# Altium project PCB_Project.PrjPcb
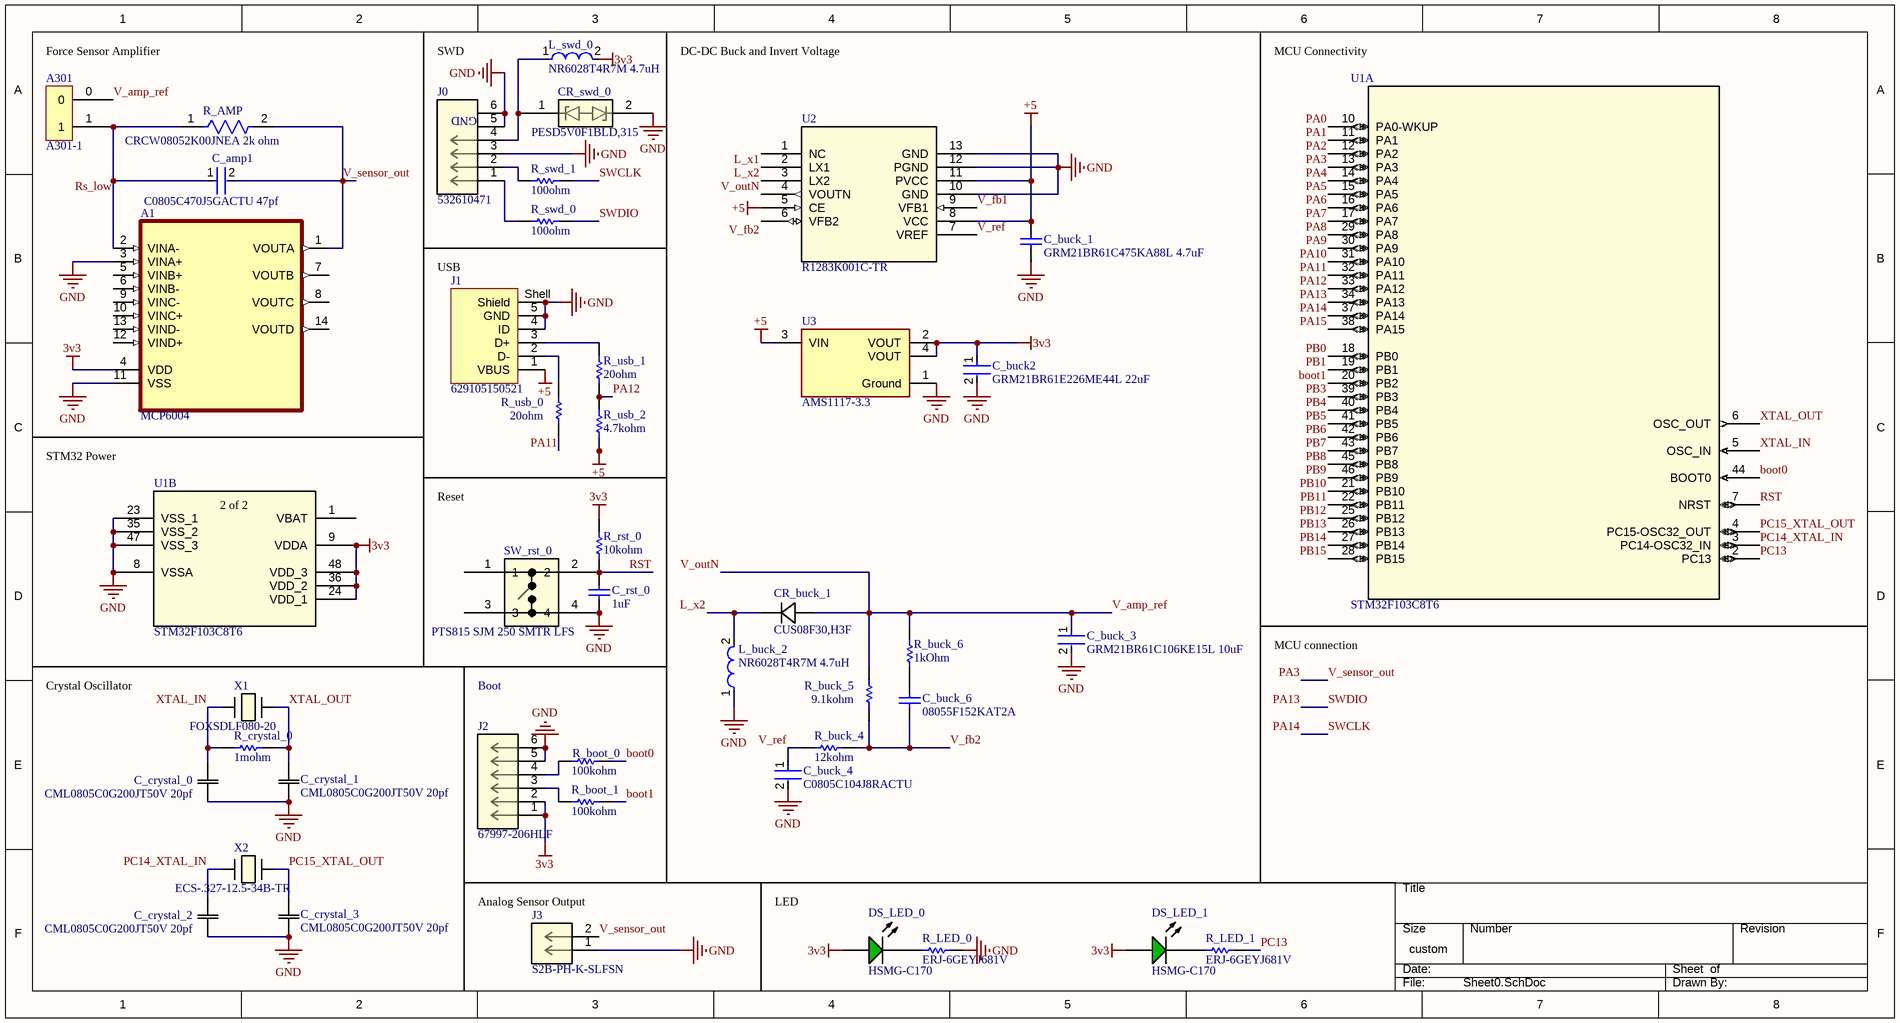
[diagram p0: Sheet0.SchDoc]
1 sheet, 44 parts. Net scope: global (net labels, ports and power ports of the same name join across sheets).
Board file: PCB.PcbDoc

## Sheet Sheet0.SchDoc
size 355 x 190 mm; SheetNumber: 1; SheetTotal: 1

### Parts
A1  MCP6004  [SOP65P640X120-14N]
A301  A301-1  [A301-1]
C_amp1  C0805C470J5GACTU 47pf  [FP-C0805C-DN-MFG]
C_buck2  GRM21BR61E226ME44L 22uF  [FP-GRM21B-0_2-e0_2_0_7-IPC_B]
C_buck_1  GRM21BR61C475KA88L 4.7uF  [CAPC2013X135X45LL10T25]
C_buck_3  GRM21BR61C106KE15L 10uF  [FP-GRM21B-0_1-IPC_C]
C_buck_4  C0805C104J8RACTU  [FP-C0805C-DN-MFG]
C_buck_6  08055F152KAT2A  [CAPC2013X140X50ML20T25]
C_crystal_0  CML0805C0G200JT50V 20pf  [CAP_CML_0805_.3pF-1500pF,4700pF_STP]
C_crystal_1  CML0805C0G200JT50V 20pf  [CAP_CML_0805_.3pF-1500pF,4700pF_STP]
C_crystal_2  CML0805C0G200JT50V 20pf  [CAP_CML_0805_.3pF-1500pF,4700pF_STP]
C_crystal_3  CML0805C0G200JT50V 20pf  [CAP_CML_0805_.3pF-1500pF,4700pF_STP]
C_rst_0  1uF  [CAPC2013X140X50ML20T25]
CR_buck_1  CUS08F30,H3F  [USC_TOS]
CR_swd_0  PESD5V0F1BLD,315  [DFN1006D-2_SOD882D_NEX]
DS_LED_0  HSMG-C170  [AVAG-HSMX-C170_V]
DS_LED_1  HSMG-C170  [AVAG-HSMX-C170_V]
J0  532610471  [CONN_532610001-SD_04_MOL]
J1  629105150521  [629105150521]
J2  67997-206HLF  [6Pins_AMP]
J3  S2B-PH-K-SLFSN  [CONN_S2B-PH-K-S_JST]
L_buck_2  NR6028T4R7M 4.7uH  [FP-NR6028-MFG]
L_swd_0  NR6028T4R7M 4.7uH  [FP-NR6028-MFG]
R_AMP  CRCW08052K00JNEA 2k ohm  [FP-CRCW0805-e3-MFG]
R_boot_0  100kohm  [RESC2013X70X40ML20T20]
R_boot_1  100kohm  [RESC2013X70X40ML20T20]
R_buck_4  12kohm  [RESC2013X60X40ML20T25]
R_buck_5  9.1kohm  [RESC2013X70X40NL20T20]
R_buck_6  1kOhm  [RESC2013X60X35ML10T20]
R_crystal_0  1mohm  [RESC2013X50X30LL20T20]
R_LED_0  ERJ-6GEYJ681V  [RESC2013X70X40LL20T20]
R_LED_1  ERJ-6GEYJ681V  [RESC2013X70X40LL20T20]
R_rst_0  10kohm  [RESC2013X60X40LL20T25_A]
R_swd_0  100ohm  [RESC2013X60X40ML20T25]
R_swd_1  100ohm  [RESC2013X60X40ML20T25]
R_usb_0  20ohm  [RESC2013X70X40ML20T20]
R_usb_1  20ohm  [RESC2013X70X40ML20T20]
R_usb_2  4.7kohm  [RESC2013X60X40ML20T25]
SW_rst_0  PTS815 SJM 250 SMTR LFS  [SW4_PTS815 SJM 250 SMTR LFS_CNK]
U1  STM32F103C8T6  [LQFP48_STM]  (parts A,B of 2)
U2  R1283K001C-TR  [PE-DFNPL2730-12-180404_NMD]
U3  AMS1117-3.3  [FP-AMS1117-IPC_C]
X1  FOXSDLF080-20  [CRYSTAL_HC49SDLF_FXT]
X2  ECS-.327-12.5-34B-TR  [XTAL_ECS-31B_ECS]

### Nets
3v3: A1.4(VDD) C_buck2.1 DS_LED_0.1(A) DS_LED_1.1(A) J2.1 J2.2 L_swd_0.2 R_rst_0.2 U1.9(VDDA) U1.24(VDD_1) U1.36(VDD_2) U1.48(VDD_3) U3.2(VOUT) U3.4(VOUT)
+5: C_buck_1.2 J1.1(VBUS) R_usb_2.1 U2.5(CE) U2.8(VCC) U2.11(PVCC) U3.3(VIN)
GND: A1.3(VINA+) A1.11(VSS) C_buck2.2 C_buck_1.1 C_buck_3.2 C_buck_4.2 C_crystal_0.1 C_crystal_1.1 C_crystal_2.1 C_crystal_3.1 C_rst_0.1 CR_swd_0.2 J0.3 J0.5 J0.6 J1.4(ID) J1.5(GND) J1.Shell(Shield) J2.5 J2.6 J3.1 L_buck_2.1 R_LED_0.2 SW_rst_0.4 U1.8(VSSA) U1.23(VSS_1) U1.35(VSS_2) U1.47(VSS_3) U2.10(GND) U2.12(PGND) U2.13(GND) U3.1(Ground)
boot0: R_boot_0.2 U1.44(BOOT0)
boot1: R_boot_1.2 U1.20(PB2)
L_x1: U2.2(LX1)
L_x2: CR_buck_1.1(cathode) L_buck_2.2 U2.3(LX2)
PA0: U1.10(PA0-WKUP)
PA1: U1.11(PA1)
PA2: U1.12(PA2)
PA3: A1.1(VOUTA) C_amp1.2 J3.2 R_AMP.2 U1.13(PA3)  [also labelled V_sensor_out]
PA4: U1.14(PA4)
PA5: U1.15(PA5)
PA6: U1.16(PA6)
PA7: U1.17(PA7)
PA8: U1.29(PA8)
PA9: U1.30(PA9)
PA10: U1.31(PA10)
PA11: R_usb_0.1 U1.32(PA11)
PA12: R_usb_1.1 R_usb_2.2 U1.33(PA12)
PA13: R_swd_0.2 U1.34(PA13)  [also labelled SWDIO]
PA14: R_swd_1.2 U1.37(PA14)  [also labelled SWCLK]
PA15: U1.38(PA15)
PB0: U1.18(PB0)
PB1: U1.19(PB1)
PB3: U1.39(PB3)
PB4: U1.40(PB4)
PB5: U1.41(PB5)
PB6: U1.42(PB6)
PB7: U1.43(PB7)
PB8: U1.45(PB8)
PB9: U1.46(PB9)
PB10: U1.21(PB10)
PB11: U1.22(PB11)
PB12: U1.25(PB12)
PB13: U1.26(PB13)
PB14: U1.27(PB14)
PB15: U1.28(PB15)
PC13: R_LED_1.2 U1.2(PC13)
PC14_XTAL_IN: C_crystal_2.2 U1.3(PC14-OSC32_IN) X2.1
PC15_XTAL_OUT: C_crystal_3.2 U1.4(PC15-OSC32_OUT) X2.2
Rs_low: A1.2(VINA-) A301.1 C_amp1.1 R_AMP.1
RST: C_rst_0.2 R_rst_0.1 SW_rst_0.2 U1.7(NRST)
V_amp_ref: A301.0 C_buck_3.1 CR_buck_1.2(anode) R_buck_5.2 R_buck_6.2 U2.4(VOUTN)  [also labelled V_outN]
V_fb1: U2.9(VFB1)
V_fb2: C_buck_6.1 R_buck_4.2 R_buck_5.1 U2.6(VFB2)
V_ref: C_buck_4.1 R_buck_4.1 U2.7(VREF)
XTAL_IN: C_crystal_0.2 R_crystal_0.1 U1.5(OSC_IN) X1.1
XTAL_OUT: C_crystal_1.2 R_crystal_0.2 U1.6(OSC_OUT) X1.2
NetC_buck_6_2: C_buck_6.2 R_buck_6.1
NetCR_swd_0_1: CR_swd_0.1 J0.4 L_swd_0.1
NetDS_LED_0_2: DS_LED_0.2(K) R_LED_0.1
NetDS_LED_1_2: DS_LED_1.2(K) R_LED_1.1
NetJ0_1: J0.1 R_swd_0.1
NetJ0_2: J0.2 R_swd_1.1
NetJ1_2: J1.2(D-) R_usb_0.2
NetJ1_3: J1.3(D+) R_usb_1.2
NetJ2_3: J2.3 R_boot_1.1
NetJ2_4: J2.4 R_boot_0.1

Not connected (* = marked no-connect by the designer): A1 5(VINB+) 6(VINB-) 7(VOUTB) 8(VOUTC) 9(VINC-) 10(VINC+) 12(VIND+) 13(VIND-) 14(VOUTD); SW_rst_0 1 3; U1 1(VBAT); U2 1(NC)

### Notes on the sheet
- (near A301) Force Sensor Amplifier
- SWD
- DC-DC Buck and Invert Voltage
- MCU Connectivity
- USB
- STM32 Power
- Reset
- Crystal Oscillator
- Boot
- MCU connection
- (near J3) Analog Sensor Output
- LED
- (in symbol 532610471) GND
- (in symbol STM32F103C8T6, part B) 2 of 2

### Library data of the parts
C_amp1 = CMP-2007-00435-2: CAP CER 47PF 50V C0G/NP0 0805; Manufacturer: KEMET; Temperature Characteristic: C0G; Temperature Coefficient: 30ppm/°C; Tolerance: 0.05; Temperature Range High: +125°C; Device Class L1: Passive Components; Device Class L3: Ceramic Capacitors; Lead Free: Yes; Manufacturer Part Number: C0805C470J5GACTU; Material: Ceramic; Temperature: -55°C to +125°C; Capacitance: 47 pF; Height: 0.88mm; Octopart: https://octopart.com/c0805c470j5gactu-kemet-150274; RoHS: TRUE; Category: Cap; Voltage Rating: 50 V; Automotive: No; Device Class L2: Capacitors; Value: 47 pF; Ipc Land Pattern Name: CAPC200125X78; Temperature Range Low: -55°C; Mouser Description: Multilayer Ceramic Capacitors MLCC - SMD/SMT 50volts 47pF C0G 5%; Package: C0805C-DN; Digikey Description: CAP CER 47PF 50V C0G/NP0 0805; ComponentLink2URL: https://content.kemet.com/datasheets/KEM_C1003_C0G_SMD.pdf; ComponentLink2Description: Datasheet
C_buck2 = CMP-2007-03222-3: Chip Multilayer Ceramic Capacitors for General Purpose, 0805, 22uF, X5R, 15%, 20%, 25V; Case/Package: 0805; Depth: 1.25mm; Resistor Type: Ceramic; Voltage Rating: 25V; Lead Free: Lead Free; Voltage Rating (DC): 25V; Case Code (Metric): 2012; Thickness: 0.057inch; REACH SVHC: No SVHC; Material: Ceramic; Tolerance: 20%; Length: 2mm; Capacitance: 22uF; Case Code (Imperial): 0805; Max Operating Temperature: 85°C; Termination: SMD/SMT; Weight: 0.000335oz; Dielectric: X5R; Packaging: Tape and Reel; Voltage: 25V; Package Quantity: 3000; Height: 1.25mm; Mount: Surface Mount; Width: 1.25mm; Min Operating Temperature: -55°C
C_buck_1 = CMP-1662-00015-2: Chip Capacitor, 4.7 uF, +/- 10%, 16 V, -55 to 85 degC, 0805 (2012 Metric), RoHS, Tape and Reel; Voltage Rating (DC): 16 V; Type (Capacitors): X5R; Case\/Package: 0805; Pins: 2; DatasheetVersion: 03/2016; REACH SVHC: No SVHC; Tolerance: 10%; PartNumber: GRM21BR61C475KA88L; Width: 1.25 mm; Capacitance: 4.7 uF; Mount: Surface Mount; ComponentLink1Description: Manufacturer URL; Case Code (Metric): 2012; PackageDescription: 2-Pin Surface Mount Device, Body 2 x 1.25 mm; Height: 1.25 mm; Voltage Rating: 16 V; Max Operating Temperature: 85 degC; RoHSCompliant: true; Length: 2 mm; ComponentLink1URL: http://www.murata.com/; Mounting Technology: Surface Mount; Packaging: Tape and Reel; Min Operating Temperature: -55 degC; ComponentLink2Description: Datasheet; Case Code (Imperial): 0805; Radiation Hardening: No; Package Quantity: 3000; PackageReference: 0805; ComponentLink2URL: http://search.murata.co.jp/Ceramy/image/img/A01X/G101/ENG/GRM21BR61C475KA88-01.pdf
C_buck_3 = CMP-2007-03453-2: Chip Multilayer Ceramic Capacitors for General Purpose, 0805, 10uF, X5R, 15%, 10%, 16V; Radiation Hardening: No; Thickness: 0.053inch; Voltage Rating (DC): 16V; Lead Free: Lead Free; Package Quantity: 1; Width: 1.25mm; Case Code (Imperial): 0805; Depth: 1.25mm; Packaging: Tape and Reel; Dielectric: X5R; Max Operating Temperature: 85°C; Tolerance: 10%; Voltage Rating: 16V; Voltage: 16V; Capacitance: 10uF; Height: 1.25mm; Case Code (Metric): 2012; Material: Ceramic; Mount: Surface Mount; Case/Package: 0805; REACH SVHC: No SVHC; Length: 2mm; Min Operating Temperature: -55°C; Termination: SMD/SMT
C_buck_4 = CMP-03020-032188-1: CAP CER 0.1UF 10V 5% X7R 0805; Manufacturer: KEMET; Tolerance: 0.05; Capacitance: 0.10 μF; Temperature Coefficient: 30ppm/°C; Value: 0.10 μF; Package: C0805C-DN; Device Class L1: Passive Components; Temperature: -55°C to +125°C; Category: Cap; RoHS: TRUE; Mouser Description: Multilayer Ceramic Capacitors MLCC - SMD/SMT 10volts 0.1uF X7R 5%; Lead Free: Yes; Temperature Range Low: -55°C; Material: Ceramic; Temperature Range High: +125°C; Device Class L2: Capacitors; Temperature Characteristic: X7R; Device Class L3: Ceramic Capacitors; ComponentLink2Description: Datasheet; Automotive: No; Ipc Land Pattern Name: CAPC200125X78; Manufacturer Part Number: C0805C104J8RACTU; Voltage Rating: 10 V; Height: 0.88mm; Digikey Description: CAP CER 0.1UF 10V 5% X7R 0805; Octopart: https://octopart.com/c0805c104j8ractu-kemet-11807087; ComponentLink2URL: https://content.kemet.com/datasheets/KEM_C1003_C0G_SMD.pdf
C_buck_6 = CMP-2007-04787-1: Manufacturer: AVX Interconnect / Elco; Part Number: 08055F152KAT2A
C_crystal_0-C_crystal_3 = CML0805C0G200JT50V: No Description Available; Mfr_Name: Stackpole International
C_rst_0 = CMP-2007-03236-1: Manufacturer: Kemet; Part Number: C0805C105K5RACTU
CR_buck_1 = CUS08F30,H3F: No Description Available; Mfr_Name: Toshiba Electronic Devices & Storage Corp.
CR_swd_0 = PESD5V0F1BLD,315: No Description Available; Mfr_Name: Nexperia; RefDes: RefDes; Type: Type
DS_LED_0 DS_LED_1 = CMP-2000-05062-1: Chip LED, Green, 2.2 V, -40 to 85 degC, 2-Pin SMD, Pb-Free, Tape and Reel; Manufacturer: Avago; No. of Pins: 2; Peak Wavelength: 570nm; SVHC: NoSVHC(16-Jun-2014); Dominant Wavelength: 572nm; Forward Current If: 20mA; Viewing Angle: 170deg; Lens Shape: Rectangular; PIV Max: 5V; External Width: 1.25mm; LED Type: Standard; External Depth: 0.8mm; Opto Mounting Orientation: Top; Luminous Intensity: 15mcd; Luminous Intensity Min: 4mcd; Forward Voltage VF Max: 2.6V; External Length / Height: 2mm; Bulb Size: 1.25mmx1.4mm; Light Area Height: 1mm; Voltage Vf Typ: 2.2V; Operating Temperature Max: 85degC; Datasheet Version: Oct-08; MSL: MSL2A-4weeks; Peak Forward Current: 20mA; Package Description: 2-Pin Surface Mount Device, Body 2 x 1.25 mm, Height 0.8 mm; Datasheet URL: https://datasheet.ciiva.com/29280/180495-da-01-en-chip-led-hsmg-c170-gelb-gruen-29280971.pdf; Storage Temperature Min: -40degC; LED Colour: Green; Wavelength Typ: 570nm; Mounting Type: SMD; Forward Current If Max: 20mA; Dominant Wavelength Typ: 572nm; LED Mounting: SMD; Operating Temperature Range: -30degCto+85degC; Operating Temperature Min: -30degC; Manufacturer URL: http://www.avagotech.com/; Packaging: CutTape; Luminous Intensity Typ: 15mcd; Package Reference: HSMX-C170; Storage Temperature Max: 85degC; Opto Case Style: SMD; Forward Voltage: 2.2V
J0 = 532610471: No Description Available; Mfr_Name: Molex Connector Corporation; RefDes: RefDes; Type: Type
J1 = CMP-1502-03252-3: NexarPartId: 52645113; Number of Contacts: 5; Contact Resistance: 30mΩ; Connector Type: USB; Voltage Rating: 30V; Current Rating: 3A; USB Standard: USB 2.0; Gender: Receptacle; Insulation Resistance: 1GΩ; Height: 2.86mm; REACH SVHC: Unknown; RoHS: Compliant; Features: Shielded; Termination: SMD/SMT; Number of Pins: 5; Contact Plating: Gold; Packaging: Tape and Reel; Contact Material: Gold; Mount: Horizontal, Surface Mount; Max Operating Temperature: 85°C; Lead Free: Lead Free; Min Operating Temperature: -40°C; Orientation: Horizontal; Operating Supply Voltage: 30V
J2 = 67997-206HLF: No Description Available; Mfr_Name: Amphenol ICC; RefDes: RefDes; Type: Type
J3 = S2B-PH-K-SLFSN: No Description Available; Mfr_Name: JST; RefDes: RefDes; Type: Type
L_buck_2 L_swd_0 = CMP-14484-000037-2: SMD Power Inductors 4.7uH ±20% 2.7A 40.3mΩ; Max DC Current: 3A; Shielding: Shielded; Core Material: Ferrite; Test Frequency: 100kHz; Self Resonant Frequency: 39MHz; DC Resistance (DCR): 40.3mR; Package Quantity: 2000; Mount: Surface Mount; Max Operating Temperature: 120°C; Min Operating Temperature: -25°C; Series: NR; Case/Package: 2424; Depth: 6.2mm; Inductance Tolerance: 20%; Halogen Free: Halogen Free; Inductance: 4.7uH; Tolerance: 20%; RoHS Compliant: Yes; Width: 0.236inch; Length: 0.236inch; Lead Free: Lead Free; Radiation Hardening: No; Packaging: Tape and Reel; Number of Pins: 2; Saturation Current: 2.7A; Current Rating: 3A; Height - Seated (Max): 0.11inch; RMS Current (Irms): 3A; Termination: SMD/SMT; Height: 2.8mm; Resistor Type: Wirewound
R_AMP = CMP-2001-03757-2: RES Thick Film, 2kΩ, 5%, 0.125W, 200ppm/°C, 0805; Voltage Rating: 150V; Max Power Dissipation: 125mW; Resistance: 2kR; Package Quantity: 1; Case Code (Imperial): 0805; Case Code (Metric): 2012; Number of Terminations: 2; Height: 0.02inch; Case/Package: 0805; Depth: 1.25mm; Military Standard: Not; Length: 2mm; Temperature Coefficient: 200ppm/°C; Weight: 0.000194oz; Composition: Thick Film; Features: Automotive AEC-Q200; Contact Plating: Tin; Radiation Hardening: No; Number of Pins: 2; Max Operating Temperature: 155°C; Termination: SMD/SMT; Tolerance: 5%; Min Operating Temperature: -55°C; Voltage Rating (DC): 150V; Width: 0.049inch; Power Rating: 125mW; Packaging: Tape and Reel; Lead Free: Lead Free
R_boot_0 R_boot_1 = CMP-2001-04377-1: Part Number: ERJ-6ENF1003V; Manufacturer: Panasonic
R_buck_4 = CMP-2001-00590-1: Part Number: ERA6AEB123V; Manufacturer: Panasonic
R_buck_5 = CMP-2001-00577-1: Part Number: ERJ6ENF9101V; Manufacturer: Panasonic
R_buck_6 = CMP-2100-03671-1: Chip Resistor, 1 KOhm, +/- 1%, 125 mW, -55 to 155 degC, 0805 (2012 Metric), RoHS, Tape and Reel; Manufacturer: Yageo; Temperature Coefficient: 100ppm/degreesC; Voltage Rating (DC): 150V; Max Power Dissipation: 125mW; Number of Pins: 2; Number of Terminations: 2; Datasheet URL: http://www.yageo.com/NewPortal/yageodocoutput?fileName=/pdf/R-Chip/PYu-RC_Group_51_RoHS_L_5.pdf; Length: 0.079inch; Package Description: 2-Pin Surface Mounted Device, Body 2 x 1.25 mm; Depth: 1.25mm; Height: 0.024inch; Military Standard: Not; Case/Package: 0805; Package Reference: 0805; RoHSCompliant: true; Lead Free: LeadFree; Packaging: TapeandReel; Package Quantity: 1; Resistance: 1KOhm; Datasheet Version: Rev. 5, 10/2016; Tolerance: 1%; Min Operating Temperature: -55degC; Voltage Rating: 150V; Composition: ThickFilm; Case Code (Imperial): 0805; Power Rating: 125mW; Width: 0.049inch; Case Code (Metric): 2012; Manufacturer URL: http://www.yageo.com/; Max Operating Temperature: 155degC; REACH SVHC: Unknown; Termination: SMD/SMT
R_crystal_0 = CMP-2001-03632-1: Manufacturer: Vishay Dale; Part Number: CRCW08051M00JNEA
R_LED_0 R_LED_1 = CMP-2001-00440-1: Manufacturer: Panasonic; Part Number: ERJ-6GEYJ681V
R_rst_0 = CMP-2001-00582-2: Metal Film Chip Resistor, High Reliability Type, 0.125 W, +/- 0.1%, -55 to 155 degC, 0805 (2012 Metric), RoHS, Tape and Reel; Voltage Rating: 100V; Power Rating: 125mW(1/8W); Brand: Panasonic; Temperature Coefficient: 25PPM/C; Resistance: 10kOhms; Product Category: ThinFilmResistors-SMD; Datasheet Version: 02/2016; Operating Temperature Range: -55Cto+155C; Length: 2mm; Mounting Technology: SurfaceMount; Manufacturer URL: http://www.panasonic.com/; Width: 1.25mm; Packaging: Reel; Product: ThinFilmResistorsSMD; Package / Case: 0805(2012metric); Termination Style: SMD/SMT; Tolerance: 0.1%; Datasheet URL: https://industrial.panasonic.com/cdbs/www-data/pdf/RDM0000/AOA0000C307.pdf; Package Description: 2-Pin Surface Mount Device, Body 2 x 1.25 mm; Factory Pack Quantity: 5000; Series: ERA-6A; Case Code - mm: 2012; RoHS: Details; Package Reference: 0805; Height: 0.5mm; Manufacturer: Panasonic; Case Code - in: 0805; Type: MetalFilmChipResistors
R_swd_0 R_swd_1 = CMP-2001-00580-1: Manufacturer: Panasonic; Part Number: ERA6AEB101V
R_usb_0 R_usb_1 = CMP-1013-00316-2: Manufacturer: Panasonic; Part Number: ERJ-6ENF20R0V
R_usb_2 = CMP-2001-00644-1: Part Number: ERA6AEB472V; Manufacturer: Panasonic
SW_rst_0 = PTS815 SJM 250 SMTR LFS: No Description Available; Mfr_Name: C&K Components; RefDes: RefDes; Type: Type
U1 = STM32F103C8T6: No Description Available; Mfr_Name: STMicroelectronics; RefDes: RefDes; Type: Type
U2 = R1283K001C-TR: No Description Available; Mfr_Name: Nisshinbo Micro Devices; Type: Power Management; RefDes: RefDes
U3 = CMP-209535-000001-1: LDO Voltage Regulators 1A, 3.3V; Manufacturer: Advanced Monolithic Systems; Dropout Voltage: 1.1V; Output Type: Fixed; Nominal Supply Current: 5mA; Max Power Dissipation: 1.2W; Max Supply Voltage: 15V; Number Of Outputs: 1; Standoff Height: 0.64mm; Max Junction Temp: +125°C; Height: 1.8mm; Package: AMS1117; Device Class L2: Power Management ICs; ComponentLink2Description: Datasheet; ComponentLink2URL: http://www.advanced-monolithic.com/pdf/ds1117.pdf; Category: IC; RoHS: TRUE; Automotive: No; Device Class L1: Integrated Circuits (ICs); Output Current: 1A; Device Class L3: Voltage Regulators - Linear; Temperature: -40°C to +125°C; Output Voltage: 3.3V; Manufacturer Part Number: AMS1117-3.3; Temperature Range Low: -40°C; Octopart: https://octopart.com/ams1117-3.3-advanced+monolithic+systems-25899300; Lead Free: Yes; Ipc Land Pattern Name: SOT229P700X180-4; Temperature Range High: +125°C
X1 = FOXSDLF080-20: No Description Available; Mfr_Name: Fox; Digi-Key_Part_Number_3: 631-1010-6-ND; Digi-Key_Part_Number_2: 631-1010-2-ND; Digi-Key_Part_Number_1: 631-1010-1-ND
X2 = ECS-.327-12.5-34B-TR: No Description Available; Mfr_Name: ECS International